# Altium schematic sheet TMC.SchDoc
size A
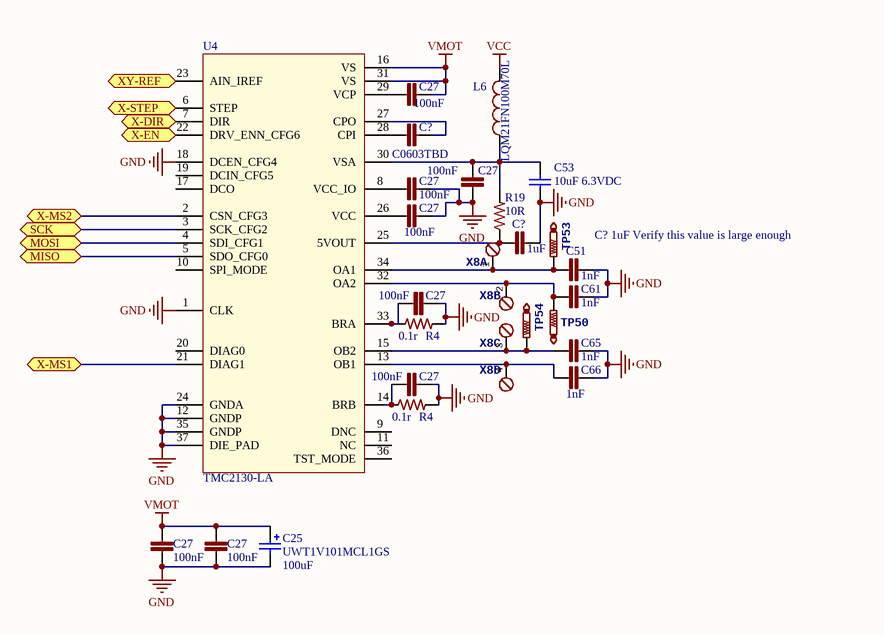
[diagram p0: TMC.SchDoc]

## Parts
(Parts that share a designator on the sheet are numbered #1, #2 ... from top to bottom, then left to right.)
C25  UWT1V101MCL1GS  value 100uF  [CAP-ELEC-063063077]
C27#1  100nF  [C0603]
C27#2  100nF  [C0603]
C27#3  100nF  [C0603]
C27#4  100nF  [C0603]
C27#5  100nF  [C0603]
C27#6  100nF  [C0603]
C27#7  100nF  [C0603]
C27#8  100nF  [C0603]
C51  1nF  [C0603]
C53  value 10uF 6.3VDC  [C0603]  (hidden comment: 0603)
C61  1nF  [C0603]
C65  1nF  [C0603]
C66  1nF  [C0603]
C?#1  C0603TBD  [C0603]
C?#2  1uF  [C0603]
L6  LQM21FN100M70L  [C0805]
R4#1  0.1r  [R1206]
R4#2  0.1r  [R1206]
R19  10R  [R0402]
TP50  TestPoint  [TP1-27]  (value not drawn)  (no BOM)
TP53  TestPoint  [TP1-27]  (value not drawn)  (no BOM)
TP54  TestPoint  [TP1-27]  (value not drawn)  (no BOM)
U4  TMC2130-LA  [QFN36-50P500X600X900_HS-37N]
X8  MPT4  [4POL254]  (value not drawn)  (parts A,B,C,D of 4)

## Ports
MISO, MOSI, SCK, X-DIR, X-EN, X-MS1, X-MS2, X-STEP, XY-REF

## Nets
GND: C25.2 C27#2.1 C27#3.1 C27#4.1 C27#5.1 C27#6.1 C27#7.1 C27#8.1 C51.2 C53.1 C61.2 C65.2 C66.2 C?#2.2 R4#1.2 R4#2.2 U4.1(CLK) U4.12(GNDP) U4.18(DCEN_CFG4) U4.24(GNDA) U4.35(GNDP) U4.37(DIE_PAD)
VCC: L6.2
VMOT: C25.1 C27#1.2 C27#7.2 C27#8.2 U4.16(VS) U4.31(VS)
MISO: U4.5(SDO_CFG0) ; port MISO
MOSI: U4.4(SDI_CFG1) ; port MOSI
SCK: U4.3(SCK_CFG2) ; port SCK
X-DIR: U4.7(DIR) ; port X-DIR
X-EN: U4.22(DRV_ENN_CFG6) ; port X-EN
X-MS1: U4.21(DIAG1) ; port X-MS1
X-MS2: U4.2(CSN_CFG3) ; port X-MS2
X-STEP: U4.6(STEP) ; port X-STEP
XY-REF: U4.23(AIN_IREF) ; port XY-REF
NetC27#1_1: C27#1.1 U4.29(VCP)
NetC27#2_2: C27#2.2 C53.2 L6.1 R19.2 U4.30(VSA)
NetC27#3_2: C27#3.2 U4.8(VCC_IO)
NetC27#4_2: C27#4.2 U4.26(VCC)
NetC27#5_2: C27#5.2 R4#1.1 U4.33(BRA)
NetC27#6_2: C27#6.2 R4#2.1 U4.14(BRB)
NetC51_1: C51.1 TP53.TP U4.34(OA1) X8.1
NetC61_1: C61.1 TP50.TP U4.32(OA2) X8.2
NetC65_1: C65.1 TP54.TP U4.15(OB2) X8.3
NetC66_1: C66.1 U4.13(OB1) X8.4
NetC?#1_1: C?#1.1 U4.28(CPI)
NetC?#1_2: C?#1.2 U4.27(CPO)
NetC?#2_1: C?#2.1 R19.1 U4.25(5VOUT)

Not connected (* = marked no-connect by the designer): U4 9(DNC) 10(SPI_MODE) 11(NC) 17(DCO) 19(DCIN_CFG5) 20(DIAG0) 36(TST_MODE)

## Notes on the sheet
- C? 1uF Verify this value is large enough

## Library data of the parts
C25 = UWT1V101MCL1GS: CAP ALUM 100UF 35V 20% SMD; Status: Active; Height: 7.70mm; Manufacture Part #: UWT1V101MCL1GS
C27#1-C27#8 = C0603C104K5RACTU: CAP CER 0603 100nF 50V 10% X7R; LastRevisionNote: ImportComponents; Published: 23-Apr-2014; Publisher: UltiMachine; LastRevisionDate: 23-Apr-2014; ManufacturerPartNumber: C0603C104K5RACTU; VALUE: 100nF
C51 C61 C65 C66 = C0603C102K5RACTU: CAP CER 0603  1nF 50v 10% X7R; LastRevisionNote: ImportComponents; Published: 23-Apr-2014; Publisher: UltiMachine; LastRevisionDate: 23-Apr-2014; ManufacturerPartNumber: C0603C102K5RACTU; VALUE: 1nF
C53 = C1608JB0J106K080AB: CAP CER 10UF 6.3V 10% JB 0603; MFR: TDK; Voltage: 6.3VDC; Published: 10 - Dec - 2014; LatestRevisionDate: 10 - Dec - 2014; Component Type: Chip Capacitor; MFR Part #: C1608JB0J106K080AB; Part Description: CAP CER 10UF 6.3V 10% JB 0603; Mounting Type: SMT 0603; Datasheet: http://www.tdk.com/pdf/TDKMLCCCapRange.pdf; Height: 0.9mm; Tolerance: 10%; Digikey #: 445-11185-1-ND; PackageReference: 0402
C?#1 = C0603TBD: Capacitor Non Polarized; LastRevisionNote: ImportComponents; Published: 23-Apr-2014; Publisher: UltiMachine; LastRevisionDate: 23-Apr-2014; VALUE: C0603TBD
C?#2 = CC0603ZRY5V6BB105: CAP CER 0603 1uF 10V Y5V; LastRevisionNote: ImportComponents; Published: 23-Apr-2014; Publisher: UltiMachine; LastRevisionDate: 23-Apr-2014; ManufacturerPartNumber: CC0603ZRY5V6BB105; VALUE: 1uF
L6 = LQM21FN100M70L: IND 0805 10uH 100mA 780 mOhm 20%; ManufacturerPartNumber: CBC2012T100M; LastRevisionNote: ImportComponents; Published: 23-Apr-2014; Publisher: UltiMachine; LastRevisionDate: 23-Apr-2014; Value: LQM21FN100M70L
R4#1 R4#2 = CRM1206-FX-R100ELF: RES 1206 0.1r 0.5w 1%; LastRevisionNote: ImportComponents; Published: 23-Apr-2014; Publisher: UltiMachine; LastRevisionDate: 23-Apr-2014; ManufacturerPartNumber: CRM1206-FX-R100ELF; VALUE: 0.1r
R19 = RC0402FR-0710RL: RES SMD 10 OHM 1% 1/16W 0402; ManufacturerPartNumber: RC0402FR-0710KP; LastRevisionNote: ImportComponents; Published: 23-Apr-2014; Publisher: UltiMachine; LastRevisionDate: 23-Apr-2014; VALUE: 10R
TP50 TP53 TP54 = TestPoint: Test Point; LastRevisionNote: ImportComponents; Published: 23-Apr-2014; Publisher: UltiMachine; LastRevisionDate: 23-Apr-2014
U4 = TMC2130-LA-T
X8 = MPT4: PHOENIX CONNECTOR; LastRevisionNote: ImportComponents; LastRevisionDate: 23-Apr-2014; Published: 23-Apr-2014; Publisher: UltiMachine